# Altium schematic sheet Amp_op2.SchDoc: AmpOps de Potência
size A3; Address1: UFCG; Address2: Laboratório VIRTUS CC; Address3: Campina Grande, PB - Brasil; SheetNumber: 5; SheetTotal: 8; Project: HAT RPi 4 - Phase Shifter Fotônico; DocumentRev: 01; SCH_SCALE: N/A; Version: v1.0
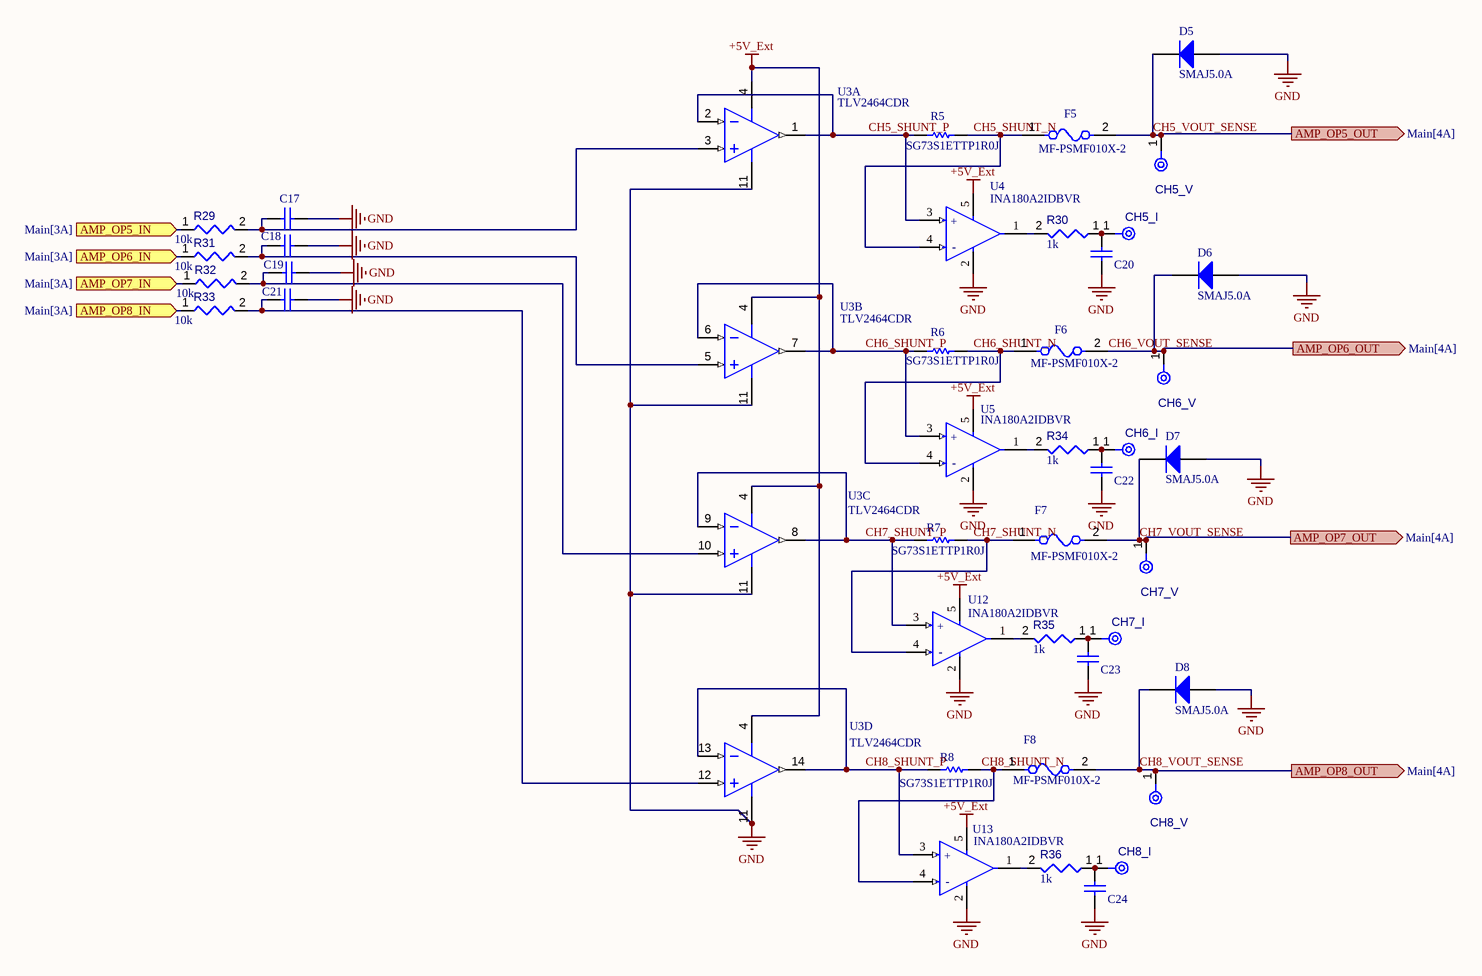
[diagram p0: Amp_op2.SchDoc]

## Parts
C17  VJ0603Y104MXJCW1BC  [CAPC1608X95X40NL15T15]  (value not drawn)
C18  VJ0603Y104MXJCW1BC  [CAPC1608X95X40NL15T15]  (value not drawn)
C19  VJ0603Y104MXJCW1BC  [CAPC1608X95X40NL15T15]  (value not drawn)
C20  VJ0603Y104MXJCW1BC  [CAPC1608X95X40NL15T15]  (value not drawn)
C21  VJ0603Y104MXJCW1BC  [CAPC1608X95X40NL15T15]  (value not drawn)
C22  VJ0603Y104MXJCW1BC  [CAPC1608X95X40NL15T15]  (value not drawn)
C23  VJ0603Y104MXJCW1BC  [CAPC1608X95X40NL15T15]  (value not drawn)
C24  VJ0603Y104MXJCW1BC  [CAPC1608X95X40NL15T15]  (value not drawn)
CH5_I  TPAD6R  [TP06R]  (value not drawn)  (no BOM)
CH5_V  TPAD6R  [TP06R]  (value not drawn)  (no BOM)
CH6_I  TPAD6R  [TP06R]  (value not drawn)  (no BOM)
CH6_V  TPAD6R  [TP06R]  (value not drawn)  (no BOM)
CH7_I  TPAD6R  [TP06R]  (value not drawn)  (no BOM)
CH7_V  TPAD6R  [TP06R]  (value not drawn)  (no BOM)
CH8_I  TPAD6R  [TP06R]  (value not drawn)  (no BOM)
CH8_V  TPAD6R  [TP06R]  (value not drawn)  (no BOM)
D5  SMAJ5.0A  [BOUR-SMA-2_V]
D6  SMAJ5.0A  [BOUR-SMA-2_V]
D7  SMAJ5.0A  [BOUR-SMA-2_V]
D8  SMAJ5.0A  [BOUR-SMA-2_V]
F5  MF-PSMF010X-2  [FP-MF-PSMF-MFG]
F6  MF-PSMF010X-2  [FP-MF-PSMF-MFG]
F7  MF-PSMF010X-2  [FP-MF-PSMF-MFG]
F8  MF-PSMF010X-2  [FP-MF-PSMF-MFG]
R5  SG73S1ETTP1R0J  [RESC1005X40X25LL10T10]
R6  SG73S1ETTP1R0J  [RESC1005X40X25LL10T10]
R7  SG73S1ETTP1R0J  [RESC1005X40X25LL10T10]
R8  SG73S1ETTP1R0J  [RESC1005X40X25LL10T10]
R29  value 10k  [RESC0603(1608)_L]  (hidden comment: Resistor 10k +/-1% 0603 100 mW)
R30  value 1k  [RESC0603(1608)_L]  (hidden comment: Resistor 1k +/-1% 0603 100 mW)
R31  value 10k  [RESC0603(1608)_L]  (hidden comment: Resistor 10k +/-1% 0603 100 mW)
R32  value 10k  [RESC0603(1608)_L]  (hidden comment: Resistor 10k +/-1% 0603 100 mW)
R33  value 10k  [RESC0603(1608)_L]  (hidden comment: Resistor 10k +/-1% 0603 100 mW)
R34  value 1k  [RESC0603(1608)_L]  (hidden comment: Resistor 1k +/-1% 0603 100 mW)
R35  value 1k  [RESC0603(1608)_L]  (hidden comment: Resistor 1k +/-1% 0603 100 mW)
R36  value 1k  [RESC0603(1608)_L]  (hidden comment: Resistor 1k +/-1% 0603 100 mW)
U3  TLV2464CDR  [D0014A_N]  (parts A,B,C,D of 4)
U4  INA180A2IDBVR  [FP-DBV0005A-MFG]
U5  INA180A2IDBVR  [FP-DBV0005A-MFG]
U12  INA180A2IDBVR  [FP-DBV0005A-MFG]
U13  INA180A2IDBVR  [FP-DBV0005A-MFG]

## Ports
AMP_OP5_IN (in, see Main[3A]), AMP_OP5_OUT (out, see Main[4A]), AMP_OP6_IN (in, see Main[3A]), AMP_OP6_OUT (out, see Main[4A]), AMP_OP7_IN (in, see Main[3A]), AMP_OP7_OUT (out, see Main[4A]), AMP_OP8_IN (in, see Main[3A]), AMP_OP8_OUT (out, see Main[4A])

## Nets
+5V_Ext: U3.4(VDD+) U4.5(VS) U5.5(VS) U12.5(VS) U13.5(VS)
GND: C17.2 C18.2 C19.2 C20.2 C21.2 C22.2 C23.2 C24.2 D5.1(A) D6.1(A) D7.1(A) D8.1(A) U3.11(GND) U4.2(GND) U5.2(GND) U12.2(GND) U13.2(GND)
AMP_OP5_IN: R29.1 ; port AMP_OP5_IN
AMP_OP6_IN: R31.1 ; port AMP_OP6_IN
AMP_OP7_IN: R32.1 ; port AMP_OP7_IN
AMP_OP8_IN: R33.1 ; port AMP_OP8_IN
CH5_SHUNT_N: F5.1 R5.2 U4.4(IN-)
CH5_SHUNT_P: R5.1 U3.1(OUT1) U3.2(IN1-) U4.3(IN+)
CH5_VOUT_SENSE: CH5_V.1(TP) D5.2(K) F5.2 ; port AMP_OP5_OUT
CH6_SHUNT_N: F6.1 R6.2 U5.4(IN-)
CH6_SHUNT_P: R6.1 U3.6(IN2-) U3.7(OUT2) U5.3(IN+)
CH6_VOUT_SENSE: CH6_V.1(TP) D6.2(K) F6.2 ; port AMP_OP6_OUT
CH7_SHUNT_N: F7.1 R7.2 U12.4(IN-)
CH7_SHUNT_P: R7.1 U3.8(OUT3) U3.9(IN3-) U12.3(IN+)
CH7_VOUT_SENSE: CH7_V.1(TP) D7.2(K) F7.2 ; port AMP_OP7_OUT
CH8_SHUNT_N: F8.1 R8.2 U13.4(IN-)
CH8_SHUNT_P: R8.1 U3.13(IN4-) U3.14(OUT4) U13.3(IN+)
CH8_VOUT_SENSE: CH8_V.1(TP) D8.2(K) F8.2 ; port AMP_OP8_OUT
NetC17_1: C17.1 R29.2 U3.3(IN1+)
NetC18_1: C18.1 R31.2 U3.5(IN2+)
NetC19_1: C19.1 R32.2 U3.10(IN3+)
NetC20_1: C20.1 CH5_I.1(TP) R30.1
NetC21_1: C21.1 R33.2 U3.12(IN4+)
NetC22_1: C22.1 CH6_I.1(TP) R34.1
NetC23_1: C23.1 CH7_I.1(TP) R35.1
NetC24_1: C24.1 CH8_I.1(TP) R36.1
NetR30_2: R30.2 U4.1(OUT)
NetR34_2: R34.2 U5.1(OUT)
NetR35_2: R35.2 U12.1(OUT)
NetR36_2: R36.2 U13.1(OUT)

## Notes on the sheet
- REVISION
- DESCRIPTION
- DATE
- APPROVED
- ADDRESS
- PROJECT
- VERSION
- TITLE
- A3
- SIZE
- SCALE
- DOCUMENT NAME:
- DOCUMENT REVISION:
- OF
- SHEET:
- PROJECT REVISION:
- (in symbol CMP-04895-000287-1) +; -

## Library data of the parts
C17-C24 = CMP-2006-00058-1: Manufacturer: Vitramon; Part Number: VJ0603Y104MXJCW1BC
CH5_I CH5_V CH6_I CH6_V CH7_I CH7_V CH8_I CH8_V = CMP-00028-00002-2: 0.6mm round; Pins: 1; Component Type: Mechanical
D5-D8 = CMP-2000-07090-1: SMAJ Transient Voltage Suppressor Diode Series, 3.5 V, -55 to 150 degC, 2-Pin SMA, RoHS, Tape and Reel; Manufacturer: Bourns; EDA / CAD Models: DownloadfromAcceleratedDesigns; Unidirectional Channels: 1; Voltage - Breakdown (Min): 6.4V; Voltage - Reverse Standoff (Typ): 5V; Voltage - Clamping (Max) @ Ipp: 9.2V; Other Names: SMAJ5.0ABDKR; Type: Zener; Catalog Drawings: SMAJSeriesFootprintSMAJ,SMBJSeries; Featured Product: SMAJ/SMBJ/SMCJ/SMLJDiscreteTVSDiodes; Power - Peak Pulse: 400W; Current - Peak Pulse (10/1000µs): 43.5A; Power Line Protection: No; Online Catalog: SMAJSeries; Supplier Device Package: SMA(DO-214AC); Operating Temperature: -55°C~150°C(TJ); Package Description: 2-Pin Surface Mount Device, Body 4.315 x 2.605 mm; Datasheet URL: https://datasheet.ciiva.com/25624/0900766b8112213b-25624680.pdf; Manufacturer URL: http://www.bourns.com/; Datasheet Version: 08/2012; Series: SMAJ; Family: TVS-Diodes; Bidirectional Channels: -; Applications: GeneralPurpose; Package Reference: SMA-2; Standard Package: 1; Package / Case: DO-214AC,SMA; Category: CircuitProtection; RoHS Information: SMAJSeriesMaterialDeclaration; Mounting Technology: SurfaceMount; Capacitance @ Frequency: -; Packaging: Digi-Reel®; Mounting Type: SurfaceMount
F5-F8 = CMP-07400-000017-1: PTC RESET FUSE 15V 100MA 0805; Manufacturer: Bourns Inc.; Resistance: 1-7.5Ω; Value: 1-7.5Ω; Current Rating: 40A; Hold Current: 0.1A; Trip Current: 0.3A; Trip Time: 1.5s; Temperature: -40°C to +85°C; ComponentLink2Description: Datasheet; Lead Free: Yes; Ipc Land Pattern Name: CAPC215135X67; Device Class L1: Circuit Protection; Mouser Description: Resettable Fuses - PPTC 0.10A 15V 1ohm; Automotive: No; Octopart: https://octopart.com/mf-psmf010x-2-bourns-7483441; Manufacturer Part Number: MF-PSMF010X-2; RoHS: TRUE; Temperature Range High: +85°C; Digikey Description: PTC RESET FUSE 15V 100MA 0805; Device Class L3: unset; ComponentLink2URL: https://www.bourns.com/docs/Product-Datasheets/mfpsmf.pdf; Height: 0.85mm; Voltage Rating: 15V; Ambient Temperature Range Low: -40°C; Category: Fuse; Package: MF-PSMF; Temperature Range Low: -40°C; Device Class L2: PTC Resettable Fuses; Ambient Temperature Range High: +85°C
R5-R8 = CMP-2002-04124-1: Manufacturer: KOA Speer; Part Number: SG73S1ETTP1R0J
R29 R31-R33 = CMP-009-00017-7: Chip Resistor, 10 KOhm, +/- 1%, 01 W, -55 to 155 degC, 0603 (1608 Metric); Manufacturer: Vishay; Manufacturer Part Number: CRCW060310K0FKEA; Voltage Rating: 50V; Power: 100mW; RoHS Compliant: True; Min Operating Temperature: -55°C; Pins: 2; Case/Package: 0603; Mounting Technology: SM; Max Operating Temperature: 155°C; Tolerance: 1%; Component Type: Resistors
R30 R34-R36 = CMP-009-00014-6: Chip Resistor, 1 KOhm, +/-1%, 0.1 W, -55 to 155 degC, 0603 (1608 Metric); Manufacturer: Yageo; Manufacturer Part Number: RC0603FR-131KL; Power: 100mW; Tolerance: 1%; Voltage Rating: 50V; Mounting Technology: SM; Case/Package: 0603; Min Operating Temperature: -55°C; RoHS Compliant: True; Max Operating Temperature: 155°C; Pins: 2; Component Type: Resistors
U3 = CMP-0271-00006-3: Quad Low Power, Rail-to-Rail Input / Output Operational Amplifier, 2.7 to 6 V, 0 to 70 degC, 14-pin SOIC (D14), Green (RoHS & no Sb/Br); Manufacturer: Texas Instruments; Offset Drift(Typ)(uV/C): 2; Total Supply Voltage(Min)(+5V is 5, +/-5V is 10): 2.7; IIB(Max)(pA): 14000; CMRR(Min)(dB): 66; Iq per channel(Max)(mA): 0.575; Vn at 1kHz(Typ)(nV/rtHz): 11; Slew Rate(Typ)(V/us): 1.6; Number of Channels: 4; Sub Family: High Output Current Amplifier (>=50mA), Low Supply Voltage Amplifier (<=2.7V), Precision Amplifier; Total Supply Voltage(Max)(+5V is 5, +/-5V is 10): 6; ComponentLink3URL: http://www.ti.com/lit/ml/mpds177g/mpds177g.pdf; ComponentLink1Description: Manufacturer URL; PackageReference: D0014A; Vio (25C)(Max)(mV): 2; Mounting Technology: Surface Mount; PackageDescription: 14-Pin Plastic Small Outline, Body 8.65 x 3.9 mm, Pitch 1.27 mm; ComponentLink2Description: Datasheet; ComponentLink3Description: Package Specification; ComponentLink1URL: http://www.ti.com/; DatasheetVersion: SLOS220J; PartNumber: TLV2464CDR; Code_JEDEC: MS-012; PackageVersion: 4040047-5/M, 06/2011; ComponentLink2URL: http://www.ti.com/general/docs/lit/getliterature.tsp?genericPartNumber=TLV2464&fileType=pdf; Eco-Plan: Green (RoHS & no Sb/Br)
U4 U5 U12 U13 = CMP-04895-000287-1: IC CURR SENSE 1 CIRCUIT SOT23-5; Operating Supply Current: 260uA; -3db Bandwidth: 350kHz; Slew Rate: 2V/µs; Number of Circuits: 1; Input Offset Voltage (Vos): 100uV; Input Bias Current: 100nA; Mount: Surface Mount; Max Operating Temperature: 125°C; Packaging: Tape and Reel; Min Operating Temperature: -40°C; Case/Package: SOT-23-5; RoHS Compliant: Yes